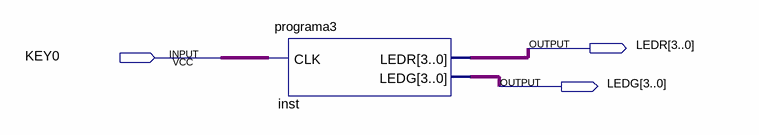
[diagram p0: schematic sheet]
// Quartus schematic programa3Demo.bdf as structural Verilog: 1 symbols, 3 pins
module programa3Demo (
  input  KEY0,
  output [3:0] LEDR,
  output [3:0] LEDG
);

  programa3 inst (.CLK(KEY0), .LEDR(LEDR), .LEDG(LEDG));
endmodule
